# Altium schematic sheet 05-UART.SchDoc
size A4
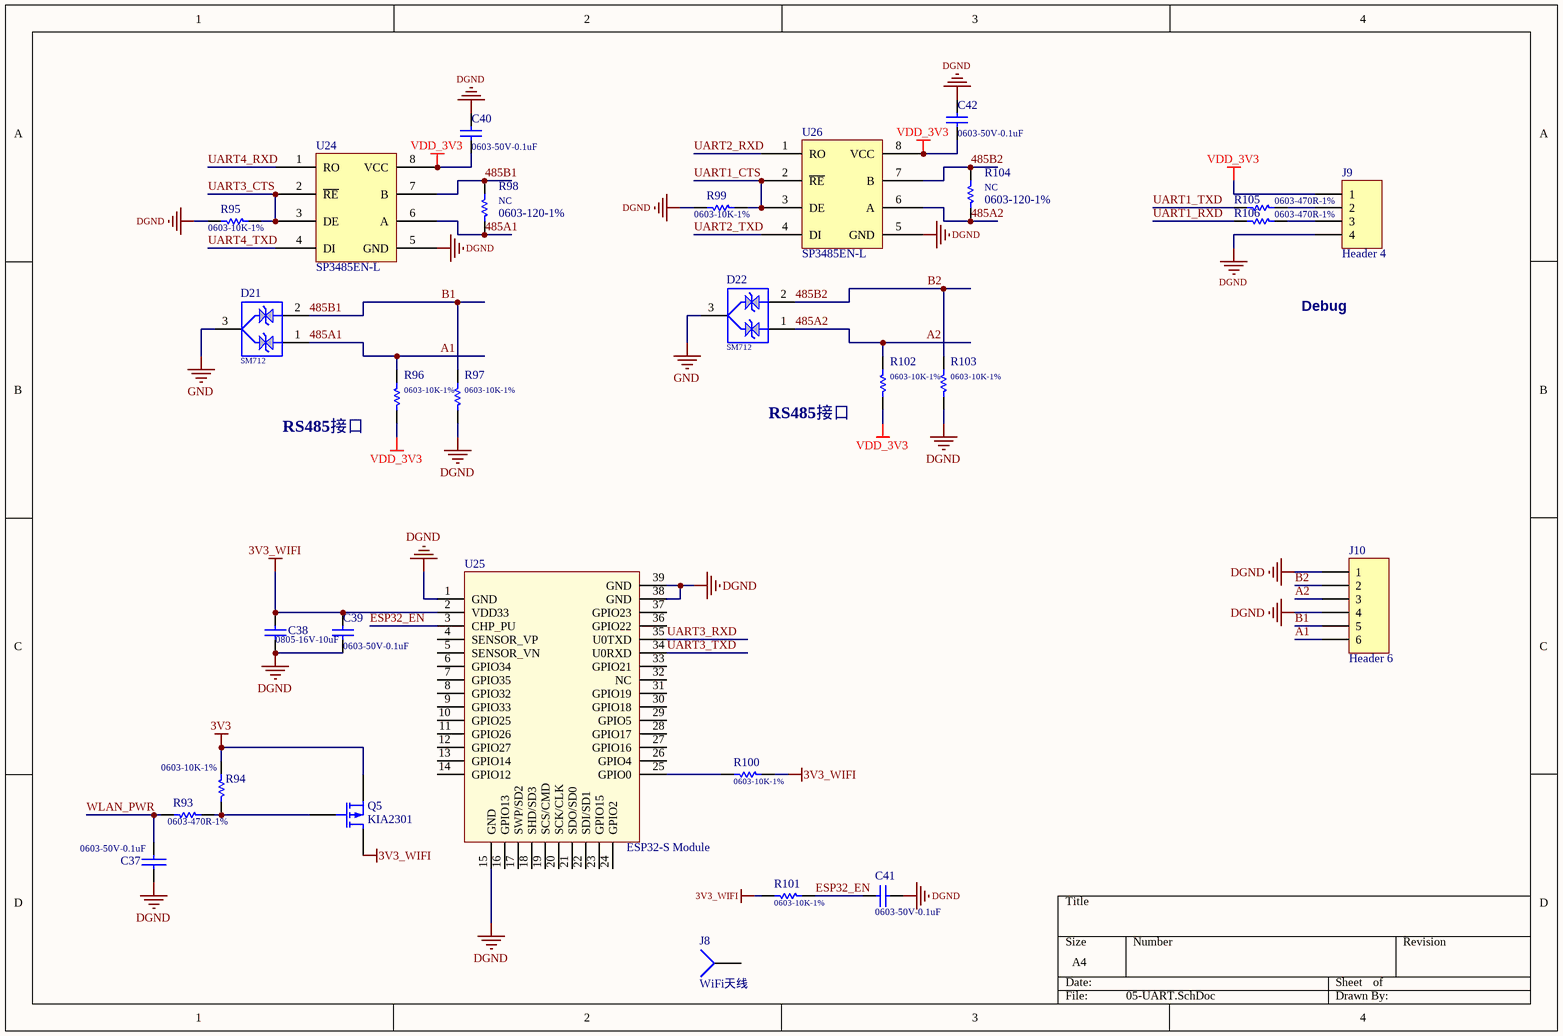
[diagram p0: 05-UART.SchDoc]

## Parts
C37  0603-50V-0.1uF  [0603C]
C38  0805-16V-10uF  [0805C - 3D]
C39  0603-50V-0.1uF  [0603C]
C40  0603-50V-0.1uF  [0603C]
C41  0603-50V-0.1uF  [0603C]
C42  0603-50V-0.1uF  [0603C]
D21  SM712  [SOT-23]
D22  SM712  [SOT-23]
J8  WiFi天线  [SMA-KWE]
J9  Header 4  [HDR1X4]
J10  Header 6  [KF2EDGR-5.08-6P]
Q5  KIA2301  [SOT-23]
R93  0603-470R-1%  [0603R]
R94  0603-10K-1%  [0603R]
R95  0603-10K-1%  [0603R]
R96  0603-10K-1%  [0603R]
R97  0603-10K-1%  [0603R]
R98  NC  value 0603-120-1%  [0603R]
R99  0603-10K-1%  [0603R]
R100  0603-10K-1%  [0603R]
R101  0603-10K-1%  [0603R]
R102  0603-10K-1%  [0603R]
R103  0603-10K-1%  [0603R]
R104  NC  value 0603-120-1%  [0603R]
R105  0603-470R-1%  [0603R]
R106  0603-470R-1%  [0603R]
U24  SP3485EN-L  [LC-SOIC-8_150mil]
U25  ESP32-S Module  [ESP32S]
U26  SP3485EN-L  [LC-SOIC-8_150mil]

## Nets
3V3: Q5.S R94.1
3V3_WIFI: C38.1 C39.1 Q5.D R100.2 R101.2 U25.2(VDD33)
DGND: C37.2 C38.2 C39.2 C40.1 C41.2 C42.1 J9.4 J10.1 J10.4 R95.2 R97.2 R99.2 R103.2 U24.5(GND) U25.1(GND) U25.15(GND) U25.38(GND) U25.39(GND) U26.5(GND)
GND: D21.3 D22.3
VDD_3V3: C40.2 C42.2 J9.1 R96.2 R102.2 U24.8(VCC) U26.8(VCC)
485A1: D21.1 J10.6 R96.1 R98.2 U24.6(A)  [also labelled A1]
485A2: D22.1 J10.3 R102.1 R104.2 U26.6(A)  [also labelled A2]
485B1: D21.2 J10.5 R97.1 R98.1 U24.7(B)  [also labelled B1]
485B2: D22.2 J10.2 R103.1 R104.1 U26.7(B)  [also labelled B2]
ESP32_EN: C41.1 R101.1 U25.3(CHP_PU)
UART1_CTS: R99.1 U26.2(~{RE}) U26.3(DE)
UART1_RXD: R106.2
UART1_TXD: R105.2
UART2_RXD: U26.1(RO)
UART2_TXD: U26.4(DI)
UART3_CTS: R95.1 U24.2(~{RE}) U24.3(DE)
UART3_RXD: U25.35(U0TXD)
UART3_TXD: U25.34(U0RXD)
UART4_RXD: U24.1(RO)
UART4_TXD: U24.4(DI)
WLAN_PWR: C37.1 R93.2
NetJ9_2: J9.2 R105.1
NetJ9_3: J9.3 R106.1
NetQ5_G: Q5.G R93.1 R94.2
NetR100_1: R100.1 U25.25(GPIO0)

Not connected (* = marked no-connect by the designer): J8 1; U25 4(SENSOR_VP) 5(SENSOR_VN) 6(GPIO34) 7(GPIO35) 8(GPIO32) 9(GPIO33) 10(GPIO25) 11(GPIO26) 12(GPIO27) 13(GPIO14) 14(GPIO12) 16(GPIO13) 17(SWP/SD2) 18(SHD/SD3) 19(SCS/CMD) 20(SCK/CLK) 21(SDO/SD0) 22(SDI/SD1) 23(GPIO15) 24(GPIO2) 26(GPIO4) 27(GPIO16) 28(GPIO17) 29(GPIO5) 30(GPIO18) 31(GPIO19) 32(NC) 33(GPIO21) 36(GPIO22) 37(GPIO23)

## Notes on the sheet
- Debug
- RS485接口

## Library data of the parts
C37 = CAP: Capacitor
C38 C41 = Cap: Capacitor; Value: 10nF; Published: 8-Jun-2000; Revision: July-2002: Re-released for DXP Platform.; Publisher: Altium Limited
C39 C40 C42 = Cap: Capacitor; Published: 8-Jun-2000; LatestRevisionDate: 17-Jul-2002; LatestRevisionNote: Re-released for DXP Platform.; PackageReference: RAD-0.3; Publisher: Altium Limited; Value: 0603-50V-0.1UF
D21 D22 = NUP2105L: TVS protect
J8 = Socket: LatestRevisionDate: 17-Jul-2002; LatestRevisionNote: Re-released for DXP Platform.; Publisher: Altium Limited
J9 = Header 4: Header, 4-Pin; LatestRevisionDate: 17-Jul-2002; LatestRevisionNote: Re-released for DXP Platform.; Publisher: Altium Limited
J10 = Header 6: Header, 6-Pin; LatestRevisionDate: 17-Jul-2002; LatestRevisionNote: Re-released for DXP Platform.; Publisher: Altium Limited
Q5 = MOSFET-P: P-Channel MOSFET; PackageDocument: 1995/1996; Published: 8-Jun-2000; LatestRevisionDate: 17-Jul-2002; LatestRevisionNote: Re-released for DXP Platform.; PackageReference: E3; Publisher: Altium Limited
R93 R94 R96 R97 R100-R103 = Res1: Resistor; Value: 1K; Published: 8-Jun-2000; LatestRevisionDate: 17-Jul-2002; LatestRevisionNote: Re-released for DXP Platform.; PackageReference: AXIAL-0.3; Publisher: Altium Limited
R95 R98 R99 R104 = Res1: Resistor; Published: 8-Jun-2000; LatestRevisionDate: 17-Jul-2002; LatestRevisionNote: Re-released for DXP Platform.; PackageReference: AXIAL-0.3; Publisher: Altium Limited
  R95 R99: Value: 0603-10K-1%
R105 R106 = Res1: Resistor; Value: 0603-10K-1%; Published: 8-Jun-2000; LatestRevisionDate: 17-Jul-2002; LatestRevisionNote: Re-released for DXP Platform.; PackageReference: AXIAL-0.3; Publisher: Altium Limited
U24 U26 = MAX485